# Altium project Service_board.PrjPcb (part 9 of 9)
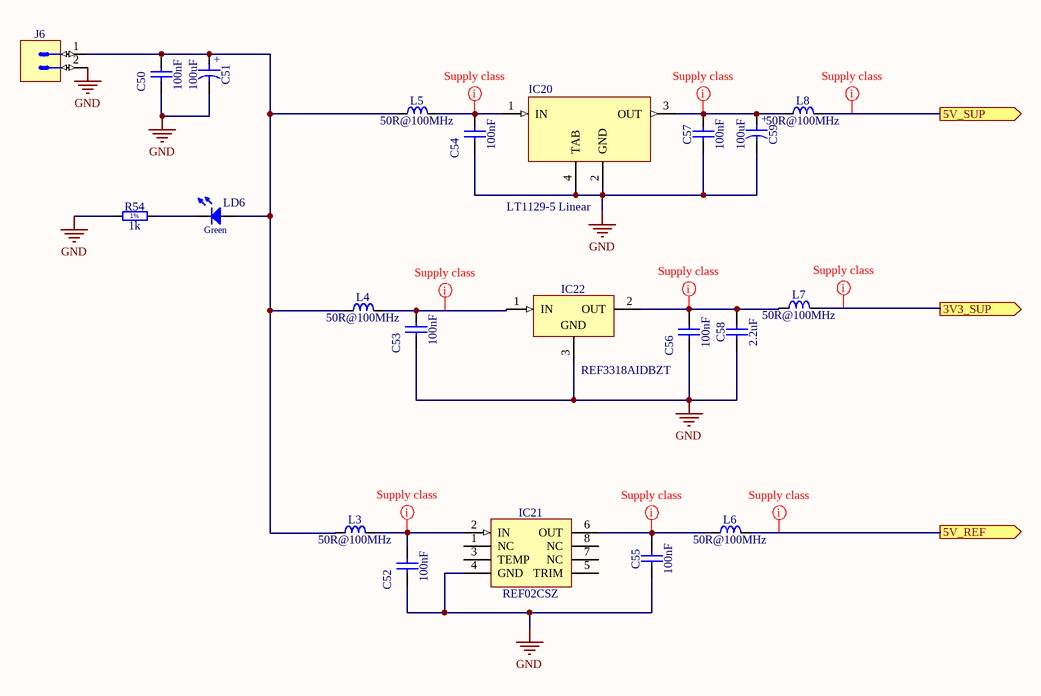
[diagram p14: Regulators.SchDoc]

## Nets that join several sheets (continued)
W_B3: MCU (D?#38.2 IC?#14.17), U_Bank/U_Channel/U_Switch (IC16_U_Bank_U_Channel_U_Switch#8.5 LD4_U_Bank_U_Channel_U_Switch#8.2)